# Altium schematic sheet USB.SchDoc: USB2.0 Type C Connection
size A4; Author: Miłosz Werner & Julia Rzepka; DrawnBy: Miłosz Werner; Organization: Wroclaw University of Science and Technology; Revision: 1.0; SheetNumber: 8; SheetTotal: 8
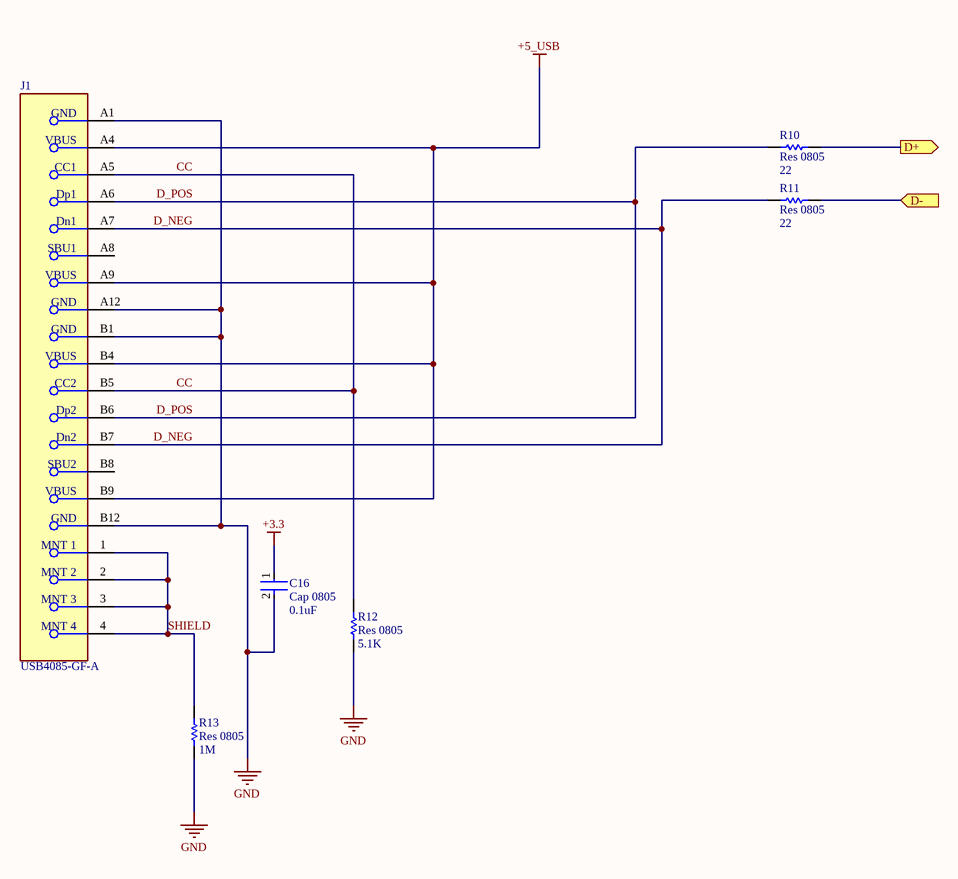
[diagram p0: USB.SchDoc]

## Parts
C16  Cap 0805  value 0.1uF  [FP-GRM216-0_1-IPC_C]
J1  USB4085-GF-A  [FP-USB4085-GF-A-MFG]
R10  Res 0805  value 22  [RESC2013X50X30LL20T20]
R11  Res 0805  value 22  [RESC2013X50X30LL20T20]
R12  Res 0805  value 5.1K  [RESC2013X50X30LL20T20]
R13  Res 0805  value 1M  [RESC2013X50X30LL20T20]

## Ports
D+ (out), D- (in)

## Nets
+3.3: C16.1
+5_USB: J1.A4(VBUS) J1.A9(VBUS) J1.B4(VBUS) J1.B9(VBUS)
GND: C16.2 J1.A1(GND) J1.A12(GND) J1.B1(GND) J1.B12(GND) R12.2 R13.2
CC: J1.A5(CC1) J1.B5(CC2) R12.1
D+: R10.1 ; port D+
D-: R11.1 ; port D-
D_NEG: J1.A7(Dn1) J1.B7(Dn2) R11.2
D_POS: J1.A6(Dp1) J1.B6(Dp2) R10.2
SHIELD: J1.1(MNT_1) J1.2(MNT_2) J1.3(MNT_3) J1.4(MNT_4) R13.1

Not connected (* = marked no-connect by the designer): J1 A8(SBU1) B8(SBU2)

## Library data of the parts
C16 = CMP-2007-00889-2: Capacitor; Capacitance: 100nF; Mount: Surface Mount; Case/Package: 0805; Case Code (Imperial): 0805
J1 = CMP-196119-000001-1: CONN RCPT USB2.0 TYPEC 16POS; Manufacturer: Global Connector Technology; Voltage Rating: 20V; Conn Orientation: Right Angle; Shielding: true; Current Rating: 4.25A; Number Of Contacts: 16; Pitch: 0.85mm; Is Female: yes; ComponentLink2URL: https://gct.co/files/drawings/usb4085.pdf; Category: Conn; Automotive: No; ComponentLink2Description: Datasheet; Height: 3.66mm; Manufacturer Part Number: USB4085-GF-A; Package: 0; Usb Standard: USB 2.0; Octopart: https://octopart.com/usb4085-gf-a-global+connector+technology-94773699; Device Class L3: unset; Digikey Description: CONN RCPT USB2.0 TYPEC 16POS; Temperature Range Low: -40°C; Temperature: -40°C to +85°C; Lead Free: Yes; Contact Material: Gold,Nickel; Device Class L1: Connectors; Temperature Range High: +85°C; Device Class L2: USB Connectors; RoHS: TRUE
R10-R13 = CMP-2001-03735-1: Resistor